# EasyEDA Pro project 电源降压电路设计.eprj

# Schematic Schematic1
Board Name: Board1; Create Date: 2024-09-02
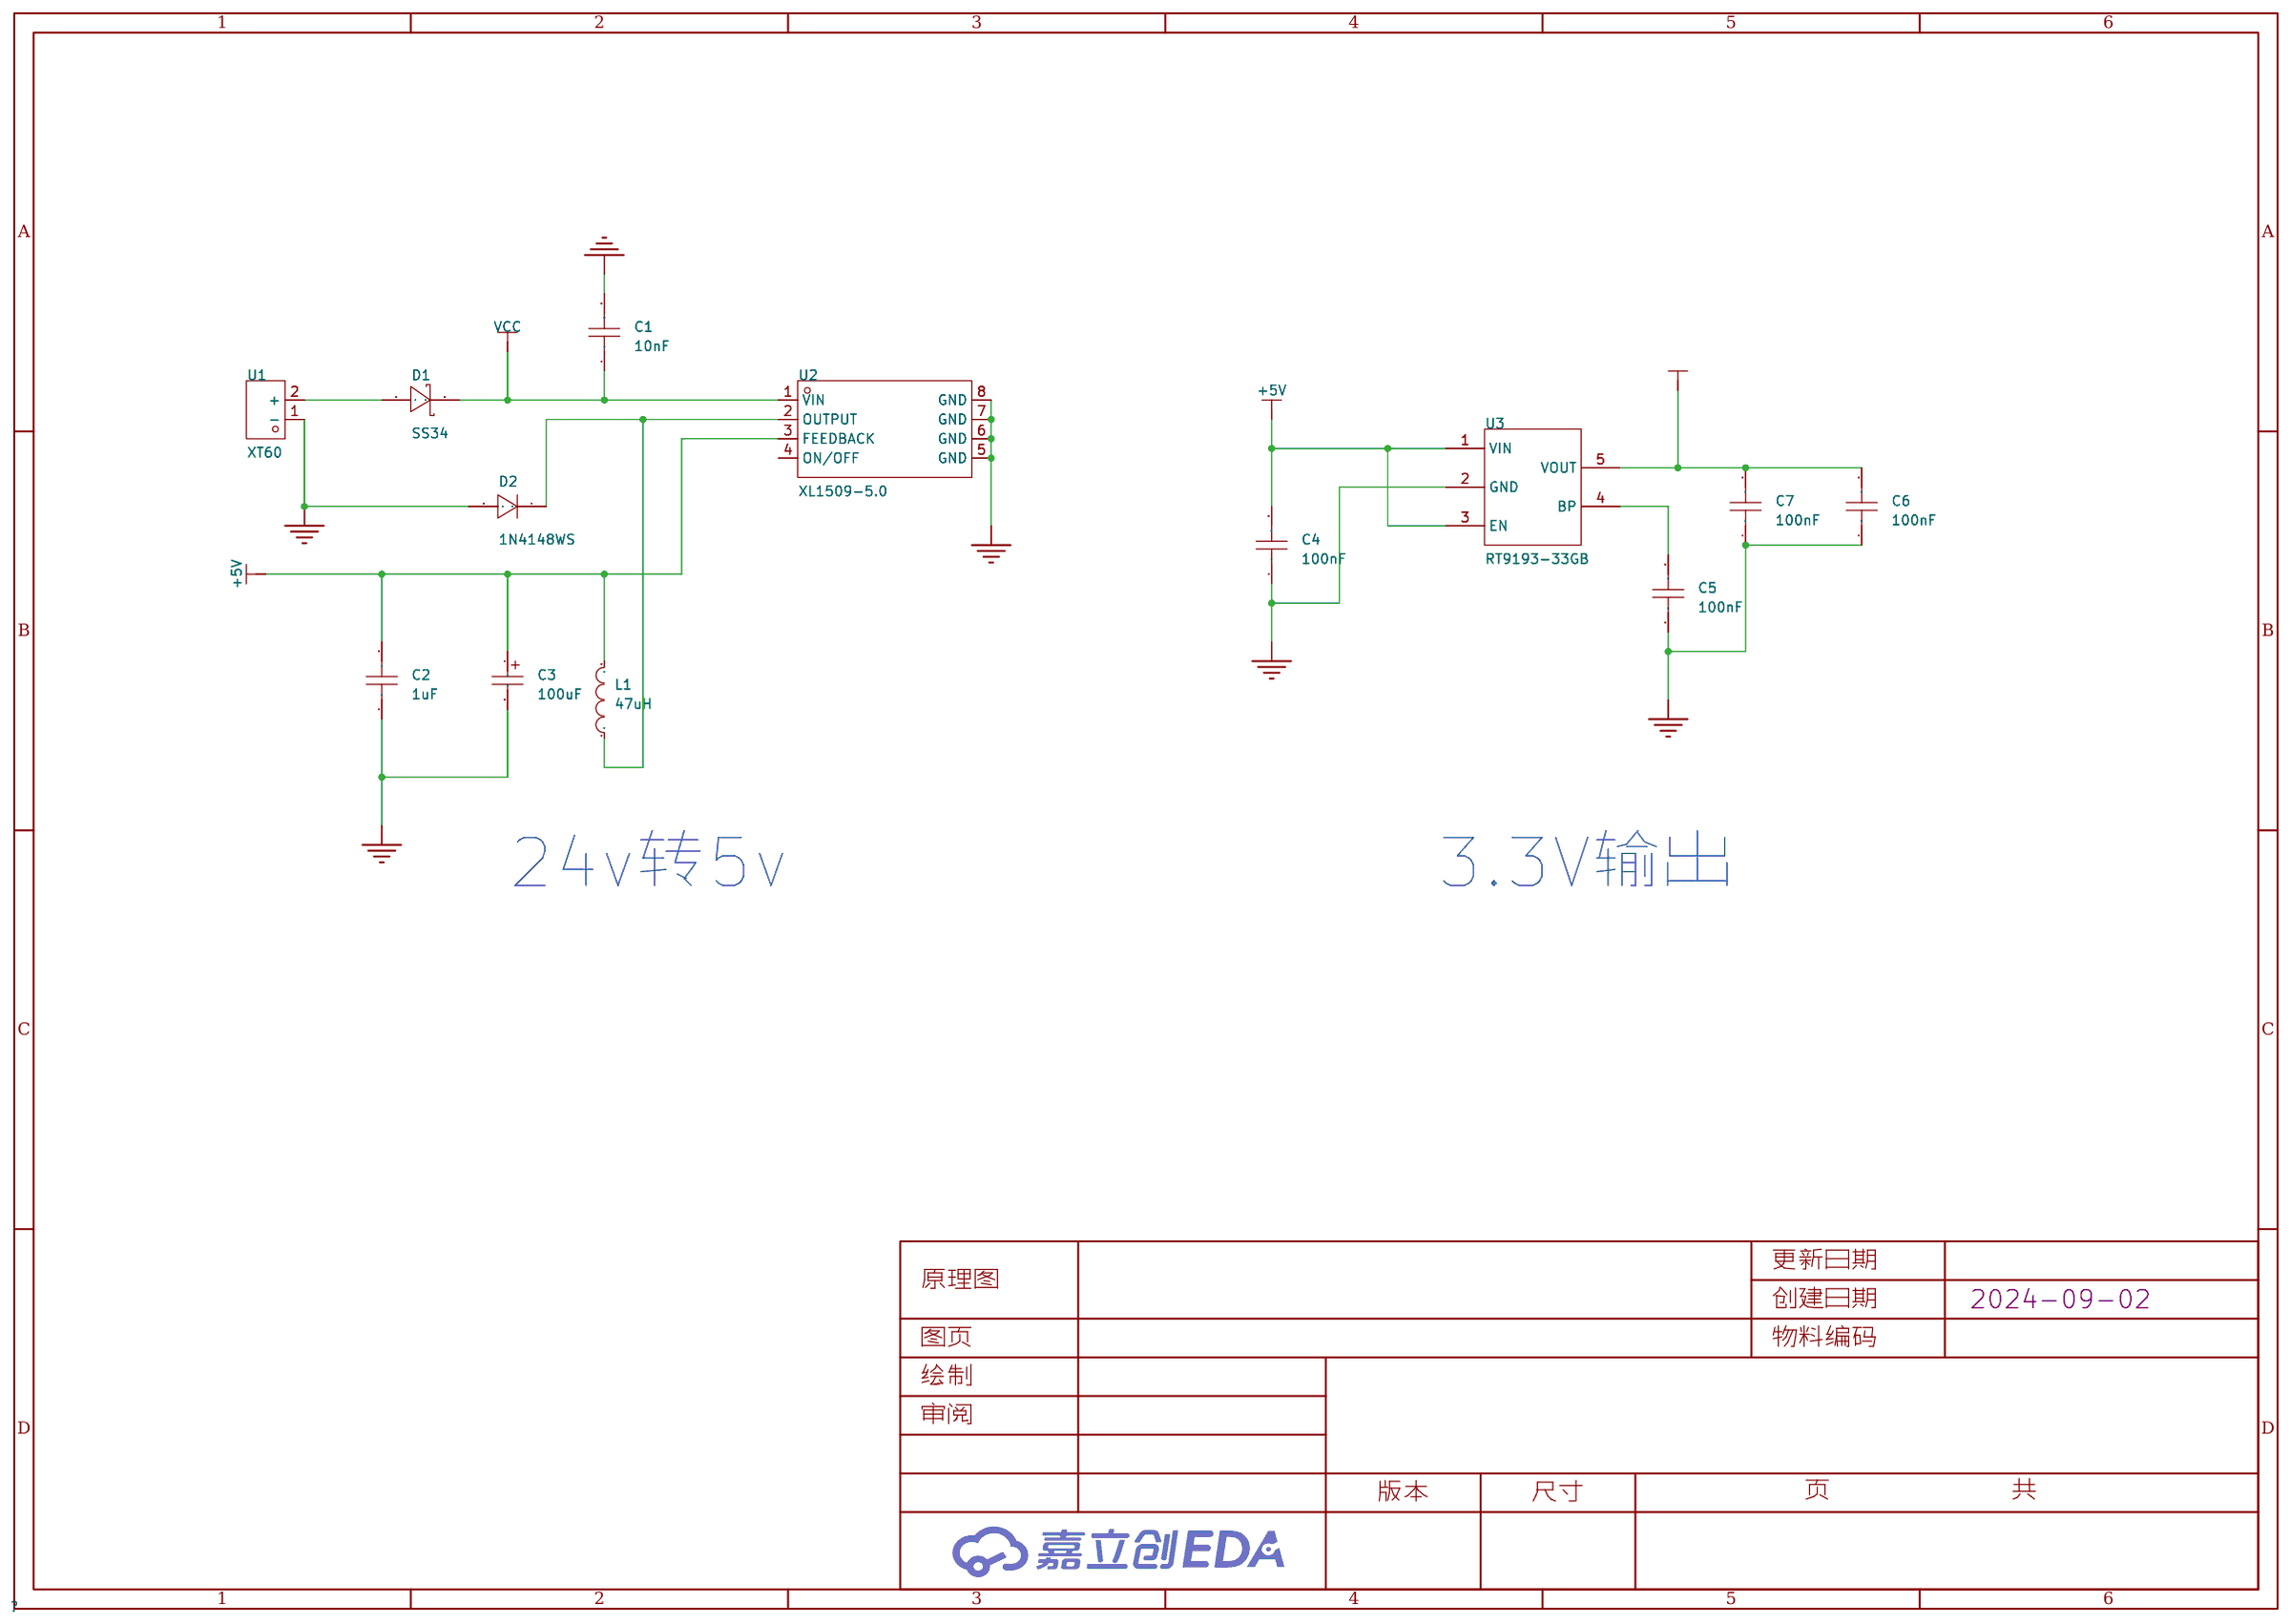
[diagram p0: schematic sheet]

## Parts
C1  10nF  [C0603]
C2  1uF  [C0603]
C3  100uF  [C_Ele_SMD_3x5.4mm]
C4  100nF  [C0603]
C5  100nF  [C0603]
C6  100nF  [C0603]
C7  100nF  [C0603]
D1  SS34  [SMA_L4.3-W2.6-LS5.2-RD]
D2  1N4148WS  [SOD-323_L1.8-W1.3-LS2.5-RD]
L1  47uH  [L0603]
U1  XT60  [CONN-TH_XT60]
U2  XL1509-5.0  [SOIC-8_L4.9-W3.9-P1.27-LS6.0-TR]
U3  RT9193-33GB  [SOT-23-5_L3.0-W1.7-P0.95-LS2.8-BL]

## Library data of the parts
C1 C2 C4-C7 = CAP_0603: Supplier Footprint: 0603
C3 = C_Ele_SMD_3x5.4mm: Supplier Footprint: SMD,3x5.4mm
D1 = SS34_C8678: LCSC Part Name: 电压:40V 电流:3A; Supplier Part: C8678; Manufacturer: MDD(辰达半导体); Supplier Footprint: SMA(DO-214AC); JLCPCB Part Class: Basic Part; Datasheet: https://atta.szlcsc.com/upload/public/pdf/source/20230314/A80AE34493C69B89E2F4B1712F433538.pdf; Supplier: LCSC; Diode Configuration: 独立式; Forward Voltage (Vf@If): 550mV@3A; Reverse Voltage (Vr): 40V; Rectified Current: 3A; Reverse Leakage Current (Ir): 500uA@40V
D2 = 1N4148WS_C2128: LCSC Part Name: 电压:100V 电流:150mA; Supplier Part: C2128; Manufacturer: CJ(江苏长电/长晶); Supplier Footprint: SOD-323; JLCPCB Part Class: Basic Part; Datasheet: https://atta.szlcsc.com/upload/public/pdf/source/20140809/1457707208178.pdf; Supplier: LCSC; Diode Configuration: 独立式; Forward Voltage (Vf@If): 1.25V@150mA; Reverse Voltage (Vr): 100V; Average Rectified Current (Io): 150mA; Power Dissipation: 200mW; Reverse Leakage Current: 1uA@75V; Reverse Recovery Time (trr): 4ns
L1 = L_0603
U1 = XT60: LCSC Part Name: AMASS(艾迈斯) XT60模型插头 3.5mm镀金香蕉头公头（电调端）XT60-M; Supplier Part: C98733; Manufacturer: AMASS(艾迈斯); JLCPCB Part Class: 扩展库; Datasheet: https://atta.szlcsc.com/upload/public/pdf/source/20170606/1496716524919.pdf; Supplier: LCSC; Brand: 艾迈斯; Type: 香蕉头; Colour: 黄色; InterfaceType: 公头; specifications: 3.5mm
U2 = XL1509-5.0: Supplier Part: C2902368; Manufacturer: UMW(友台半导体); Supplier Footprint: SOIC-8; JLCPCB Part Class: 扩展库; Datasheet: https://atta.szlcsc.com/upload/public/pdf/source/20231109/DE54E433DAEEB90BED9FFB0414881778.pdf; Supplier: LCSC
U3 = RT9193-33GB: LCSC Part Name: 输入5.5V 输出3.3V 300mA; Supplier Part: C15651; Manufacturer: RICHTEK(立锜); Supplier Footprint: SOT-23-5; JLCPCB Part Class: 扩展库; Datasheet: https://atta.szlcsc.com/upload/public/pdf/source/20130730/1457706628575.pdf; Supplier: LCSC; Output Type: 固定; Maximum Input Voltage: 5.5V; Output Voltage: 3.3V; MAX Output Current: 300mA; Power Supply Rejection Ratio (PSRR): 70dB; Dropout Voltage: 300mV@(300mA); standby current: 130uA; Operating Temperature: -40℃~+125℃; Output Polarity: 正极; Number of Outputs: 1

## Nets
3.3V: C6.2 C7.2 U3.5(VOUT)
+5V: C2.2 C3.1 C4.2 L1.2 U2.3(FEEDBACK) U3.1(VIN) U3.3(EN)
GND: C1.2 C2.1 C3.2 C4.1 C5.1 C6.1 C7.1 D2.2(A) U1.1(-) U2.5(GND) U2.6(GND) U2.7(GND) U2.8(GND) U3.2(GND)
VCC: C1.1 D1.1(K) U2.1(VIN)
Net-(C5-2): C5.2 U3.4(BP)
Net-(D1-2): D1.2(A) U1.2(+)
Net-(D2-1): D2.1(K) L1.1 U2.2(OUTPUT)

Not connected (* = marked no-connect by the designer): U2 4(ON/OFF)

## Notes on the sheet
- 24v转5v
- 3.3V输出
